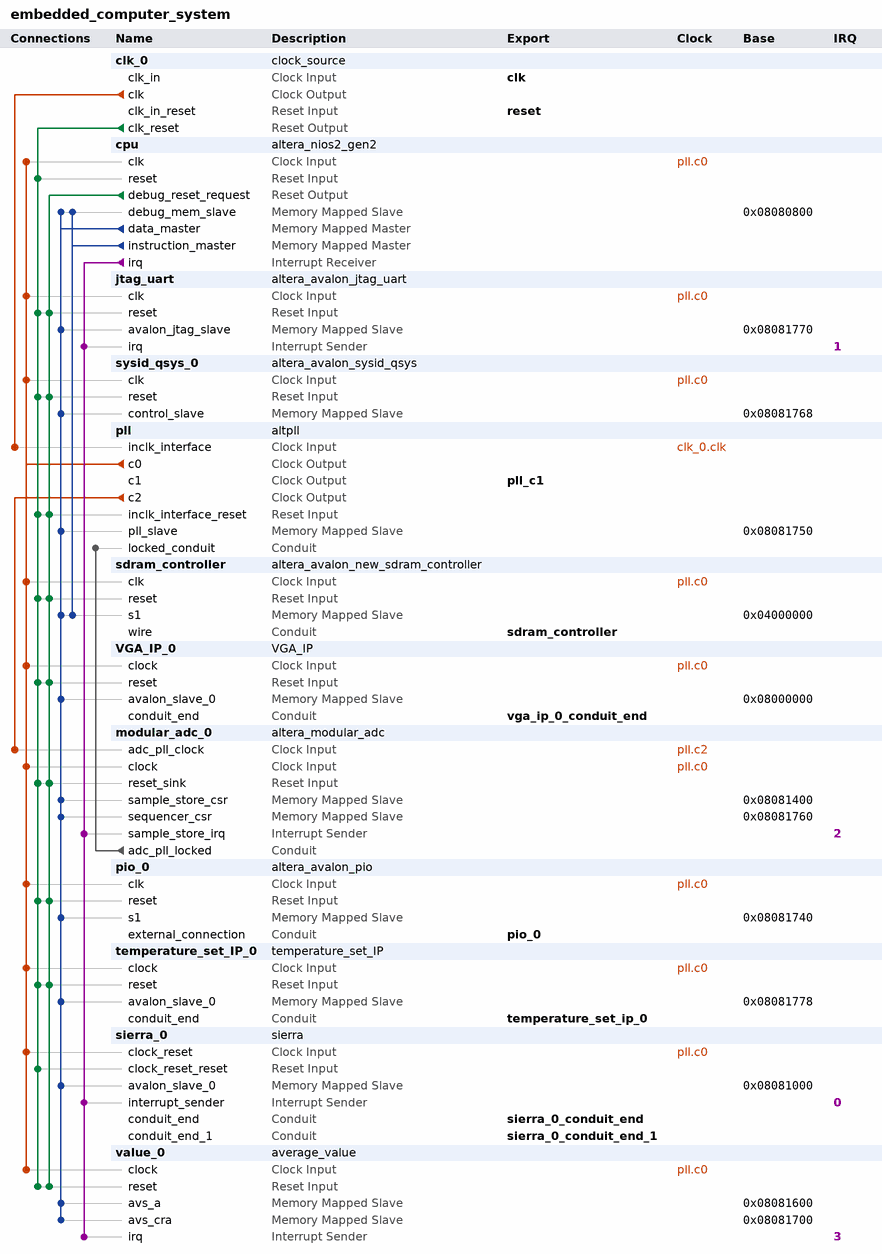
[diagram p0: system contents]
# Platform Designer (Qsys) system embedded_computer_system, MAX 10 10M50DAF484C7G
# Parameters at their usual value, and those the tool derives, are not listed.
package require -exact qsys 18.1
create_system embedded_computer_system
set_project_property DEVICE_FAMILY {MAX 10}
set_project_property DEVICE 10M50DAF484C7G

add_instance clk_0 clock_source 18.1
set_instance_parameter_value clk_0 clockFrequency 50000000

add_instance cpu altera_nios2_gen2 18.1
set_instance_parameter_value cpu dcache_size 2048
set_instance_parameter_value cpu exceptionSlave sdram_controller.s1
set_instance_parameter_value cpu icache_size 4096
set_instance_parameter_value cpu impl Tiny
set_instance_parameter_value cpu resetSlave sdram_controller.s1

add_instance jtag_uart altera_avalon_jtag_uart 18.1
set_instance_parameter_value jtag_uart simInteractiveOptions NO_INTERACTIVE_WINDOWS

add_instance sysid_qsys_0 altera_avalon_sysid_qsys 18.1
set_instance_parameter_value sysid_qsys_0 id 1

add_instance pll altpll 18.1
set_instance_parameter_value pll CLK0_DIVIDE_BY 1
set_instance_parameter_value pll CLK0_MULTIPLY_BY 1
set_instance_parameter_value pll CLK1_DIVIDE_BY 1
set_instance_parameter_value pll CLK1_DUTY_CYCLE 50
set_instance_parameter_value pll CLK1_MULTIPLY_BY 1
set_instance_parameter_value pll CLK1_PHASE_SHIFT -5000
set_instance_parameter_value pll CLK2_DIVIDE_BY 5
set_instance_parameter_value pll CLK2_DUTY_CYCLE 50
set_instance_parameter_value pll CLK2_MULTIPLY_BY 1
set_instance_parameter_value pll CLK2_PHASE_SHIFT 0
set_instance_parameter_value pll INCLK0_INPUT_FREQUENCY 20000
set_instance_parameter_value pll PORT_ARESET PORT_UNUSED
set_instance_parameter_value pll PORT_LOCKED PORT_USED
set_instance_parameter_value pll PORT_clk1 PORT_USED
set_instance_parameter_value pll PORT_clk2 PORT_USED
set_instance_parameter_value pll PORT_clk3 PORT_UNUSED

add_instance sdram_controller altera_avalon_new_sdram_controller 18.1
set_instance_parameter_value sdram_controller TAC 5.4
set_instance_parameter_value sdram_controller TRCD 15.0
set_instance_parameter_value sdram_controller TRP 15.0
set_instance_parameter_value sdram_controller casLatency 3
set_instance_parameter_value sdram_controller columnWidth 10
set_instance_parameter_value sdram_controller dataWidth 16
set_instance_parameter_value sdram_controller generateSimulationModel false
set_instance_parameter_value sdram_controller model single_Micron_MT48LC4M32B2_7_chip
set_instance_parameter_value sdram_controller numberOfBanks 4
set_instance_parameter_value sdram_controller numberOfChipSelects 1
set_instance_parameter_value sdram_controller powerUpDelay 100.0
set_instance_parameter_value sdram_controller refreshPeriod 7.8125
set_instance_parameter_value sdram_controller rowWidth 13

add_instance VGA_IP_0 VGA_IP 1.4

add_instance modular_adc_0 altera_modular_adc 18.1
set_instance_parameter_value modular_adc_0 CLOCK_FREQ 50000000
set_instance_parameter_value modular_adc_0 CORE_VAR 0
set_instance_parameter_value modular_adc_0 DEVICE_PART 10M50DAF484C7G
set_instance_parameter_value modular_adc_0 ENABLE_DEBUG 1
set_instance_parameter_value modular_adc_0 clkdiv 2
set_instance_parameter_value modular_adc_0 int_vref_vr 3.0
set_instance_parameter_value modular_adc_0 refsel 1
set_instance_parameter_value modular_adc_0 sample_rate 0
set_instance_parameter_value modular_adc_0 seq_order_length 1
set_instance_parameter_value modular_adc_0 seq_order_slot_1 1
set_instance_parameter_value modular_adc_0 seq_order_slot_2 30
set_instance_parameter_value modular_adc_0 seq_order_slot_3 30
set_instance_parameter_value modular_adc_0 seq_order_slot_4 30
set_instance_parameter_value modular_adc_0 seq_order_slot_5 30
set_instance_parameter_value modular_adc_0 seq_order_slot_6 30
set_instance_parameter_value modular_adc_0 seq_order_slot_7 30
set_instance_parameter_value modular_adc_0 use_ch0 false
set_instance_parameter_value modular_adc_0 use_ch2 false
set_instance_parameter_value modular_adc_0 use_ch3 false
set_instance_parameter_value modular_adc_0 use_ch4 false
set_instance_parameter_value modular_adc_0 use_ch5 false
set_instance_parameter_value modular_adc_0 use_ch6 false
set_instance_parameter_value modular_adc_0 use_ch7 false
set_instance_parameter_value modular_adc_0 use_ch8 false
set_instance_parameter_value modular_adc_0 use_tsd false

add_instance pio_0 altera_avalon_pio 18.1
set_instance_parameter_value pio_0 direction Output
set_instance_parameter_value pio_0 width 8

add_instance temperature_set_IP_0 temperature_set_IP 1.0

add_instance sierra_0 sierra 9.4.2

add_instance value_0 average_value 1.0

# connections
add_connection clk_0.clk pll.inclk_interface clock
add_connection pll.c0 cpu.clk clock
add_connection pll.c0 jtag_uart.clk clock
add_connection pll.c0 modular_adc_0.clock clock
add_connection pll.c0 pio_0.clk clock
add_connection pll.c0 sdram_controller.clk clock
add_connection pll.c0 sierra_0.clock_reset clock
add_connection pll.c0 sysid_qsys_0.clk clock
add_connection pll.c0 temperature_set_IP_0.clock clock
add_connection pll.c0 value_0.clock clock
add_connection pll.c0 VGA_IP_0.clock clock
add_connection pll.c2 modular_adc_0.adc_pll_clock clock
add_connection clk_0.clk_reset cpu.reset reset
add_connection clk_0.clk_reset jtag_uart.reset reset
add_connection clk_0.clk_reset modular_adc_0.reset_sink reset
add_connection clk_0.clk_reset pio_0.reset reset
add_connection clk_0.clk_reset pll.inclk_interface_reset reset
add_connection clk_0.clk_reset sdram_controller.reset reset
add_connection clk_0.clk_reset sierra_0.clock_reset_reset reset
add_connection clk_0.clk_reset sysid_qsys_0.reset reset
add_connection clk_0.clk_reset temperature_set_IP_0.reset reset
add_connection clk_0.clk_reset value_0.reset reset
add_connection clk_0.clk_reset VGA_IP_0.reset reset
add_connection cpu.debug_reset_request jtag_uart.reset reset
add_connection cpu.debug_reset_request modular_adc_0.reset_sink reset
add_connection cpu.debug_reset_request pio_0.reset reset
add_connection cpu.debug_reset_request pll.inclk_interface_reset reset
add_connection cpu.debug_reset_request sdram_controller.reset reset
add_connection cpu.debug_reset_request sysid_qsys_0.reset reset
add_connection cpu.debug_reset_request temperature_set_IP_0.reset reset
add_connection cpu.debug_reset_request value_0.reset reset
add_connection cpu.debug_reset_request VGA_IP_0.reset reset
add_connection cpu.data_master cpu.debug_mem_slave avalon
set_connection_parameter_value cpu.data_master/cpu.debug_mem_slave baseAddress 0x08080800
add_connection cpu.data_master jtag_uart.avalon_jtag_slave avalon
set_connection_parameter_value cpu.data_master/jtag_uart.avalon_jtag_slave baseAddress 0x08081770
add_connection cpu.data_master modular_adc_0.sample_store_csr avalon
set_connection_parameter_value cpu.data_master/modular_adc_0.sample_store_csr baseAddress 0x08081400
add_connection cpu.data_master modular_adc_0.sequencer_csr avalon
set_connection_parameter_value cpu.data_master/modular_adc_0.sequencer_csr baseAddress 0x08081760
add_connection cpu.data_master pio_0.s1 avalon
set_connection_parameter_value cpu.data_master/pio_0.s1 baseAddress 0x08081740
add_connection cpu.data_master pll.pll_slave avalon
set_connection_parameter_value cpu.data_master/pll.pll_slave baseAddress 0x08081750
add_connection cpu.data_master sdram_controller.s1 avalon
set_connection_parameter_value cpu.data_master/sdram_controller.s1 baseAddress 0x04000000
add_connection cpu.data_master sierra_0.avalon_slave_0 avalon
set_connection_parameter_value cpu.data_master/sierra_0.avalon_slave_0 baseAddress 0x08081000
add_connection cpu.data_master sysid_qsys_0.control_slave avalon
set_connection_parameter_value cpu.data_master/sysid_qsys_0.control_slave baseAddress 0x08081768
add_connection cpu.data_master temperature_set_IP_0.avalon_slave_0 avalon
set_connection_parameter_value cpu.data_master/temperature_set_IP_0.avalon_slave_0 baseAddress 0x08081778
add_connection cpu.data_master value_0.avs_a avalon
set_connection_parameter_value cpu.data_master/value_0.avs_a baseAddress 0x08081600
add_connection cpu.data_master value_0.avs_cra avalon
set_connection_parameter_value cpu.data_master/value_0.avs_cra baseAddress 0x08081700
add_connection cpu.data_master VGA_IP_0.avalon_slave_0 avalon
set_connection_parameter_value cpu.data_master/VGA_IP_0.avalon_slave_0 baseAddress 0x08000000
add_connection cpu.instruction_master cpu.debug_mem_slave avalon
set_connection_parameter_value cpu.instruction_master/cpu.debug_mem_slave baseAddress 0x08080800
add_connection cpu.instruction_master sdram_controller.s1 avalon
set_connection_parameter_value cpu.instruction_master/sdram_controller.s1 baseAddress 0x04000000
add_connection modular_adc_0.adc_pll_locked pll.locked_conduit conduit
add_connection cpu.irq jtag_uart.irq interrupt
set_connection_parameter_value cpu.irq/jtag_uart.irq irqNumber 1
add_connection cpu.irq modular_adc_0.sample_store_irq interrupt
set_connection_parameter_value cpu.irq/modular_adc_0.sample_store_irq irqNumber 2
add_connection cpu.irq sierra_0.interrupt_sender interrupt
set_connection_parameter_value cpu.irq/sierra_0.interrupt_sender irqNumber 0
add_connection cpu.irq value_0.irq interrupt
set_connection_parameter_value cpu.irq/value_0.irq irqNumber 3

# exported interfaces
add_interface clk clock sink
set_interface_property clk EXPORT_OF clk_0.clk_in
add_interface pio_0 conduit end
set_interface_property pio_0 EXPORT_OF pio_0.external_connection
add_interface pll_c1 clock source
set_interface_property pll_c1 EXPORT_OF pll.c1
add_interface reset reset sink
set_interface_property reset EXPORT_OF clk_0.clk_in_reset
add_interface sdram_controller conduit end
set_interface_property sdram_controller EXPORT_OF sdram_controller.wire
add_interface sierra_0_conduit_end conduit end
set_interface_property sierra_0_conduit_end EXPORT_OF sierra_0.conduit_end
add_interface sierra_0_conduit_end_1 conduit end
set_interface_property sierra_0_conduit_end_1 EXPORT_OF sierra_0.conduit_end_1
add_interface temperature_set_ip_0 conduit end
set_interface_property temperature_set_ip_0 EXPORT_OF temperature_set_IP_0.conduit_end
add_interface vga_ip_0_conduit_end conduit end
set_interface_property vga_ip_0_conduit_end EXPORT_OF VGA_IP_0.conduit_end

set_interconnect_requirement {$system} qsys_mm.clockCrossingAdapter HANDSHAKE
set_interconnect_requirement {$system} qsys_mm.enableEccProtection FALSE
set_interconnect_requirement {$system} qsys_mm.insertDefaultSlave FALSE
set_interconnect_requirement {$system} qsys_mm.maxAdditionalLatency 1

save_system embedded_computer_system.qsys
